# Altium project project.PrjPcb
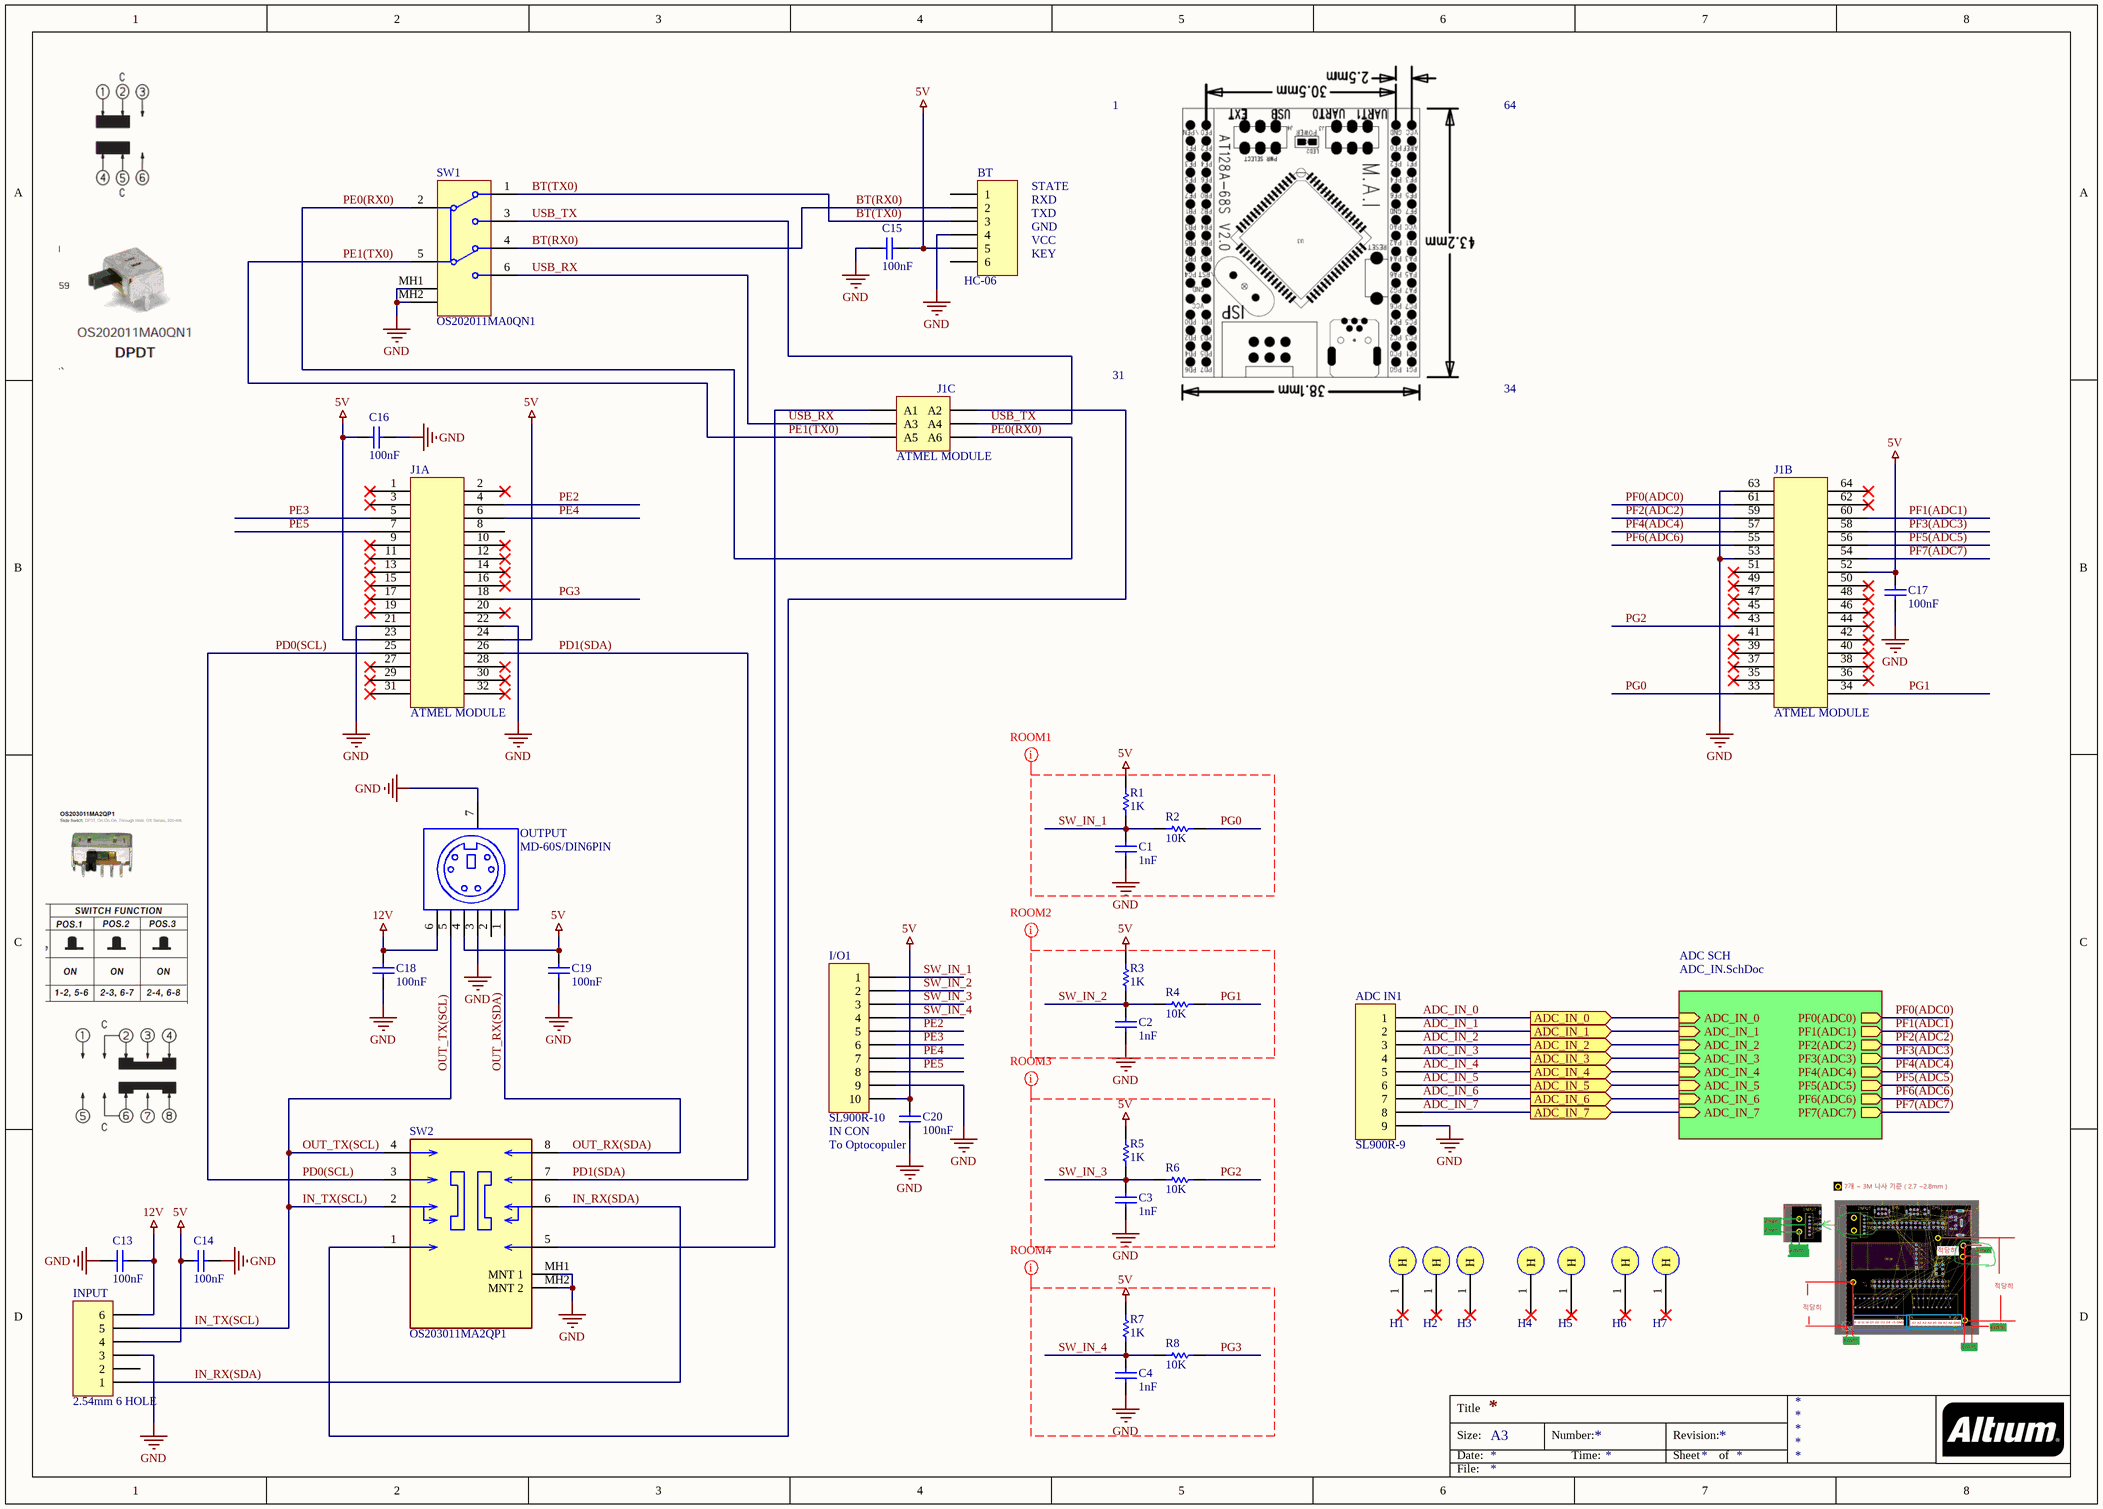
[diagram p0: CON_MCU.SchDoc]
2 sheets, 75 parts. Net scope: hierarchical (ports join the sheet entries above them; power ports are global).
Board file: Project.PcbDoc
Sheets:
  CON_MCU.SchDoc
    ADC SCH = ADC_IN.SchDoc

## Sheet CON_MCU.SchDoc
size A3

### Parts
ADC_IN1  SL900R-9  [SL-900R-9]
BT  HC-06  [HC-06]
C1  1nF  [C2012]
C2  1nF  [C2012]
C3  1nF  [C2012]
C4  1nF  [C2012]
C13  100nF  [C2012]
C14  100nF  [C2012]
C15  100nF  [C2012]
C16  100nF  [C2012]
C17  100nF  [C2012]
C18  100nF  [C2012]
C19  100nF  [C2012]
C20  100nF  [C2012]
H1  HOLE  [HOLE_3MM]  (value not drawn)
H2  HOLE  [HOLE_3MM]  (value not drawn)
H3  HOLE  [HOLE_3MM]  (value not drawn)
H4  HOLE  [HOLE_3MM]  (value not drawn)
H5  HOLE  [HOLE_3MM]  (value not drawn)
H6  HOLE  [HOLE_3MM]  (value not drawn)
H7  HOLE  [HOLE_3MM]  (value not drawn)
I/O1  SL900R-10  [SL-900R-10]
INPUT  2.54mm 6 HOLE  [2.54mm 6 HOLE]
J1  ATMEL MODULE  [ATMEL MODULE]  (parts A,B,C of 3)
OUTPUT  MD-60S/DIN6PIN  [TAIT-MDS-508B6L_V - duplicate]
R1  1K  [R2012]
R2  10K  [R2012]
R3  1K  [R2012]
R4  10K  [R2012]
R5  1K  [R2012]
R6  10K  [R2012]
R7  1K  [R2012]
R8  10K  [R2012]
SW1  OS202011MA0QN1  [OS202011MA0QN1]
SW2  OS203011MA2QP1  [OS203011MA2QP1]

### Sub-sheets
ADC SCH = ADC_IN.SchDoc: ADC_IN_0 (in), ADC_IN_1 (in), ADC_IN_2 (in), ADC_IN_3 (in), ADC_IN_4 (in), ADC_IN_5 (in), ADC_IN_6 (in), ADC_IN_7 (in), PF0(ADC0) (out), PF1(ADC1) (out), PF2(ADC2) (out), PF3(ADC3) (out), PF4(ADC4) (out), PF5(ADC5) (out), PF6(ADC6) (out), PF7(ADC7) (out)

### Ports
ADC_IN_0 (out), ADC_IN_1 (out), ADC_IN_2 (out), ADC_IN_3 (out), ADC_IN_4 (out), ADC_IN_5 (out), ADC_IN_6 (out), ADC_IN_7 (out)

### Nets
5V: BT.5 C14.2 C15.2 C16.2 C17.2 C19.2 C20.2 I/O1.10 INPUT.4 J1.23 J1.24 J1.52 OUTPUT.4 R1.2 R3.2 R5.2 R7.2
12V: C13.1 C18.2 INPUT.6 OUTPUT.6
GND: ADC_IN1.9 BT.4 C1.1 C2.1 C3.1 C4.1 C13.2 C14.1 C15.1 C16.1 C17.1 C18.1 C19.1 C20.1 I/O1.9 INPUT.3 J1.21 J1.22 J1.53 J1.63 OUTPUT.3 OUTPUT.7 SW1.MH1 SW1.MH2 SW2.MH1(MNT_1) SW2.MH2(MNT_2)
ADC_IN_0: ADC_IN1.1 ; port ADC_IN_0, sheet ADC SCH/ADC_IN_0
ADC_IN_1: ADC_IN1.2 ; port ADC_IN_1, sheet ADC SCH/ADC_IN_1
ADC_IN_2: ADC_IN1.3 ; port ADC_IN_2, sheet ADC SCH/ADC_IN_2
ADC_IN_3: ADC_IN1.4 ; port ADC_IN_3, sheet ADC SCH/ADC_IN_3
ADC_IN_4: ADC_IN1.5 ; port ADC_IN_4, sheet ADC SCH/ADC_IN_4
ADC_IN_5: ADC_IN1.6 ; port ADC_IN_5, sheet ADC SCH/ADC_IN_5
ADC_IN_6: ADC_IN1.7 ; port ADC_IN_6, sheet ADC SCH/ADC_IN_6
ADC_IN_7: ADC_IN1.8 ; port ADC_IN_7, sheet ADC SCH/ADC_IN_7
BT(RX0): BT.2 SW1.4
BT(TX0): BT.3 SW1.1
IN_RX(SDA): INPUT.1 SW2.6
IN_TX(SCL): INPUT.5 OUTPUT.5 SW2.2 SW2.4  [also labelled OUT_TX(SCL)]
OUT_RX(SDA): OUTPUT.1 SW2.8
PD0(SCL): J1.25 SW2.3
PD1(SDA): J1.26 SW2.7
PE0(RX0): J1.A6 SW1.2
PE1(TX0): J1.A5 SW1.5
PE2: I/O1.5 J1.4
PE3: I/O1.6 J1.5
PE4: I/O1.7 J1.6
PE5: I/O1.8 J1.7
PF0(ADC0): J1.61 ; sheet ADC SCH/PF0(ADC0)
PF1(ADC1): J1.60 ; sheet ADC SCH/PF1(ADC1)
PF2(ADC2): J1.59 ; sheet ADC SCH/PF2(ADC2)
PF3(ADC3): J1.58 ; sheet ADC SCH/PF3(ADC3)
PF4(ADC4): J1.57 ; sheet ADC SCH/PF4(ADC4)
PF5(ADC5): J1.56 ; sheet ADC SCH/PF5(ADC5)
PF6(ADC6): J1.55 ; sheet ADC SCH/PF6(ADC6)
PF7(ADC7): J1.54 ; sheet ADC SCH/PF7(ADC7)
PG0: J1.33 R2.1
PG1: J1.34 R4.1
PG2: J1.43 R6.1
PG3: J1.18 R8.1
SW_IN_1: C1.2 I/O1.1 R1.1 R2.2
SW_IN_2: C2.2 I/O1.2 R3.1 R4.2
SW_IN_3: C3.2 I/O1.3 R5.1 R6.2
SW_IN_4: C4.2 I/O1.4 R7.1 R8.2
USB_RX: J1.A3 SW1.6
USB_TX: J1.A4 SW1.3
NetJ1_A1: J1.A1 SW2.5
NetJ1_A2: J1.A2 SW2.1

Not connected (* = marked no-connect by the designer): BT 1 6; H1 1(H)*; H2 1(H)*; H3 1(H)*; H4 1(H)*; H5 1(H)*; H6 1(H)*; H7 1(H)*; INPUT 2; J1 1* 2* 3* 8 9* 10* 11* 12* 13* 14* 15* 16* 17* 19* 20* 27* 28* 29* 30* 31* 32* 35* 36* 37* 38* 39* 40* 41* 42* 44* 45* 46* 47* 48* 49* 50* 51* 62* 64*; OUTPUT 2

### Layout directives
mark named ROOM1: 5V, GND, PG0, SW_IN_1
mark named ROOM2: 5V, GND, PG1, SW_IN_2
mark named ROOM3: 5V, GND, PG2, SW_IN_3
mark named ROOM4: 5V, GND, PG3, SW_IN_4

### Notes on the sheet
- 1
- 64
- STATE
- RXD
- TXD
- GND
- VCC
- KEY
- 31
- 34
- IN CON
- (near C20) To Optocopuler
- Title
- Size:
- Date:
- A3
- Number:
- Time:
- Revision:
- Sheet
- of
- File:

### Library data of the parts
ADC_IN1 = Header 9: Header, 9-Pin; LatestRevisionDate: 17-Jul-2002; LatestRevisionNote: Re-released for DXP Platform.; Publisher: Altium Limited
BT INPUT = Header 6: Header, 6-Pin; LatestRevisionDate: 17-Jul-2002; LatestRevisionNote: Re-released for DXP Platform.; Publisher: Altium Limited
C1-C4 C13-C20 = CAP: Manufacturer: AVX Interconnect / Elco; Part Number: 08051A102JAT2A
H1-H7 = MH
I/O1 = Header 10: Header, 10-Pin; LatestRevisionDate: 17-Jul-2002; LatestRevisionNote: Re-released for DXP Platform.; Publisher: Altium Limited
OUTPUT = CUI-MD-60S-6: Right Angle Mini DIN Connector, 100 Vac, 12 Vdc, -40 to 85 degC, 6-Pin THD, RoHS, Bulk; Manufacturer: CUI Inc; Online Catalog: MD; Other Names: 045-0036RCP-2460MD60S; Connector Type: Receptacle,FemaleSockets; Mating Products: CP-2060-ND-CONNMINI-DIN6PINMALE; Number of Positions: 6; 3D Model: MD-60S; Current Rating: 1A,2A; Voltage - Rated: 100VAC,12VDC; Category: Connectors,Interconnects; Standard Package: 300; Mounting Technology: ThroughHole; RoHS Information: MD-x0SCertofCompliance; Operating Temperature: -40°C~85°C; Contact Finish: Silver; Orientation: Keyed; Package Reference: MD-60S; Package Description: 6-Pin Through Hole Device, Body 14 x 12.4 mm, Height 13.1 mm; Shell Material, Finish: PolybutyleneTerephthalate(PBT); Packaging: Bulk; Fastening Type: Push-Pull; Contact Finish Thickness: -; Shell Size, MIL: -; Termination: Solder; Manufacturer URL: http://www.cui.com/; Family: CircularConnectors; Series: MD; Mounting Type: ThroughHole,RightAngle; Features: -; Ingress Protection: -; Datasheet Version: Rev. 1.02, 03/2012; Datasheet URL: http://www.cui.com/product/resource/md-xxs.pdf; Shell Size - Insert: MiniDIN
R1-R8 = RES-2: Chip Resistor, 4.7 KOhm, +/- 1%, 0.125 W, -55 to 155 degC, 0805 (2012 Metric), RoHS, Tape and Reel; Manufacturer: Vishay Semiconductor; Temperature Coefficient: 100ppm/degreesC; Voltage Rating: 150V; Max Power Dissipation: 125mW; Packaging: TapeandReel; Max Operating Temperature: 155degC; Case Code (Imperial): 0805; Case/Package: 0805; Radiation Hardening: No; Package Reference: 0805; Lead Free: LeadFree; Package Description: 2-Pin Surface Mount Device, Body 2.05 x 1.25 mm; Manufacturer URL: http://www.vishay.com/; Tolerance: 1%; Height: 0.45mm; REACH SVHC: Unknown; Termination: SMD/SMT; Length: 2mm; Depth: 1.25mm; Case Code (Metric): 2012; Package Quantity: 10; Weight: 0.000194oz; Military Standard: Not; RoHSCompliant: true; Composition: ThickFilm; Contact Plating: Tin; Datasheet Version: 41061.0; Datasheet URL: https://datasheet.ciiva.com/11808/0900766b80d98b26-11808992.pdf; Width: 1.25mm; Number of Terminations: 2; Min Operating Temperature: -55degC; Power Rating: 125mW; Resistance: 4.7KOhm; Voltage Rating (DC): 150V
SW1 = SW-DPDT-6: Slide Switch, MHS Series, Double Pole, Vertical, 125 V (AC), -20 to 85 degC, 6-Pin THD, RoHS, Bulk; ComponentLink2Description: Datasheet; DatasheetVersion: Mar-08; PackageDescription: 6-Pin Through Hole Device, Body 16 x 6.7 mm, Height 12.05 mm; ComponentLink1URL: http://www.te.com/; ComponentLink1Description: Manufacturer URL; ComponentLink3Description: Package Specification; ComponentLink2URL: http://www.te.com/commerce/DocumentDelivery/DDEController?Action=showdoc&DocId=Catalog+Section%7F1308111-1_SWITCHES_CORE_PROGRAM_CATALOG%7F0308%7Fpdf%7FEnglish%7FENG_CS_1308111-1_SWITCHES_CORE_PROGRAM_CATALOG_0308.pdf%7F1825289-1; PackageReference: 1825289-1; ComponentLink3URL: http://www.te.com/commerce/DocumentDelivery/DDEController?Action=showdoc&DocId=Customer+Drawing%7F1825289%7FB3%7Fpdf%7FEnglish%7FENG_CD_1825289_B3.pdf%7F1825289-1
SW2 = CMP-17877-000002-1: SWITCH SLIDE DP3T 200MA 30V; Manufacturer Part Number: EG2301; Manufacturer: E-Switch; Electromechanical Life: 10000Cycles; Contact Resistance: 20mΩ; Current Rating: 0.2A; Temperature Range Low: -20°C; Throw Configuration: DP3T; Digikey Description: SWITCH SLIDE DP3T 200MA 30V; Device Class L2: Switches; RoHS: TRUE; Temperature Range High: +70°C; Mount: Through Hole; Lead Free: Yes; ComponentLink2Description: Datasheet; Footprint Url: http://spec_sheets.e-switch.com/specs/P040180.pdf; Category: Switch; Temperature: -20°C to +70°C; Package: EG2301; Automotive: No; Device Class L1: Electromechanical; Device Class L3: Slide Switches; ComponentLink2URL: https://www.e-switch.com/system/asset/product_line/data_sheet/119/EG.pdf; Height: 11.8mm; Octopart: https://octopart.com/eg2301-e-switch-1438660; Mouser Description: Slide Switches DP3T PC MNT SLIDE; Voltage Rating Dc: 30V; Manufacturer 1: E-Switch; Manufacturer Part Number 1: EG2301

## Sheet ADC_IN.SchDoc
size A4
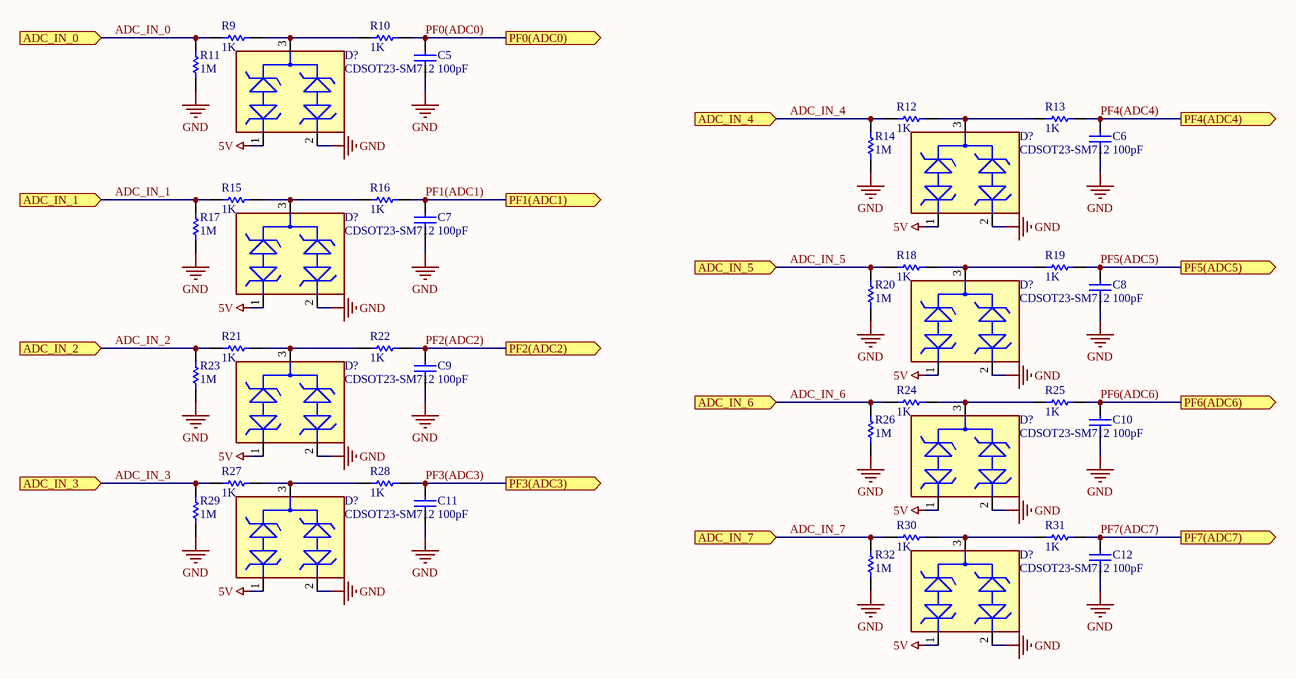
[diagram p1: ADC_IN.SchDoc]

### Parts
(Parts that share a designator on the sheet are numbered #1, #2 ... from top to bottom, then left to right.)
C5  100pF  [C2012]
C6  100pF  [C2012]
C7  100pF  [C2012]
C8  100pF  [C2012]
C9  100pF  [C2012]
C10  100pF  [C2012]
C11  100pF  [C2012]
C12  100pF  [C2012]
D?#1  CDSOT23-SM712  [FP-SOT23-MFG]
D?#2  CDSOT23-SM712  [FP-SOT23-MFG]
D?#3  CDSOT23-SM712  [FP-SOT23-MFG]
D?#4  CDSOT23-SM712  [FP-SOT23-MFG]
D?#5  CDSOT23-SM712  [FP-SOT23-MFG]
D?#6  CDSOT23-SM712  [FP-SOT23-MFG]
D?#7  CDSOT23-SM712  [FP-SOT23-MFG]
D?#8  CDSOT23-SM712  [FP-SOT23-MFG]
R9  1K  [R2012]
R10  1K  [R2012]
R11  1M  [R2012]
R12  1K  [R2012]
R13  1K  [R2012]
R14  1M  [R2012]
R15  1K  [R2012]
R16  1K  [R2012]
R17  1M  [R2012]
R18  1K  [R2012]
R19  1K  [R2012]
R20  1M  [R2012]
R21  1K  [R2012]
R22  1K  [R2012]
R23  1M  [R2012]
R24  1K  [R2012]
R25  1K  [R2012]
R26  1M  [R2012]
R27  1K  [R2012]
R28  1K  [R2012]
R29  1M  [R2012]
R30  1K  [R2012]
R31  1K  [R2012]
R32  1M  [R2012]

### Ports
ADC_IN_0 (in), ADC_IN_1 (in), ADC_IN_2 (in), ADC_IN_3 (in), ADC_IN_4 (in), ADC_IN_5 (in), ADC_IN_6 (in), ADC_IN_7 (in), PF0(ADC0) (out), PF1(ADC1) (out), PF2(ADC2) (out), PF3(ADC3) (out), PF4(ADC4) (out), PF5(ADC5) (out), PF6(ADC6) (out), PF7(ADC7) (out)

### Nets
5V: D?#1.1 D?#2.1 D?#3.1 D?#4.1 D?#5.1 D?#6.1 D?#7.1 D?#8.1
GND: C5.2 C6.2 C7.2 C8.2 C9.2 C10.2 C11.2 C12.2 D?#1.2 D?#2.2 D?#3.2 D?#4.2 D?#5.2 D?#6.2 D?#7.2 D?#8.2 R11.2 R14.2 R17.2 R20.2 R23.2 R26.2 R29.2 R32.2
ADC_IN_0: R9.2 R11.1 ; port ADC_IN_0
ADC_IN_1: R15.2 R17.1 ; port ADC_IN_1
ADC_IN_2: R21.2 R23.1 ; port ADC_IN_2
ADC_IN_3: R27.2 R29.1 ; port ADC_IN_3
ADC_IN_4: R12.2 R14.1 ; port ADC_IN_4
ADC_IN_5: R18.2 R20.1 ; port ADC_IN_5
ADC_IN_6: R24.2 R26.1 ; port ADC_IN_6
ADC_IN_7: R30.2 R32.1 ; port ADC_IN_7
PF0(ADC0): C5.1 R10.1 ; port PF0(ADC0)
PF1(ADC1): C7.1 R16.1 ; port PF1(ADC1)
PF2(ADC2): C9.1 R22.1 ; port PF2(ADC2)
PF3(ADC3): C11.1 R28.1 ; port PF3(ADC3)
PF4(ADC4): C6.1 R13.1 ; port PF4(ADC4)
PF5(ADC5): C8.1 R19.1 ; port PF5(ADC5)
PF6(ADC6): C10.1 R25.1 ; port PF6(ADC6)
PF7(ADC7): C12.1 R31.1 ; port PF7(ADC7)
NetD?#1_3: D?#1.3 R9.1 R10.2
NetD?#2_3: D?#2.3 R12.1 R13.2
NetD?#3_3: D?#3.3 R15.1 R16.2
NetD?#4_3: D?#4.3 R18.1 R19.2
NetD?#5_3: D?#5.3 R21.1 R22.2
NetD?#6_3: D?#6.3 R24.1 R25.2
NetD?#7_3: D?#7.3 R27.1 R28.2
NetD?#8_3: D?#8.3 R30.1 R31.2

### Notes on the sheet
- Title
- Size:
- Date:
- A4
- Number:
- Time:
- Revision:
- Sheet
- of
- File:

### Library data of the parts
C5-C12 = CAP: as C1 on sheet CON_MCU
D?#1-D?#8 = CMP-2000-05081-2: TVS DIODE 7V/12V 14V/26V SOT23-3; Manufacturer: Bourns Inc.; Manufacturer: Bourns; Peak Pulse Current: 17A; Standoff Height: 0.05mm; Breakdown Voltage: 7.5V; Direction: Bidirectional; Description: 26V, 14V Clamp 17A (8/20µs) Ipp Tvs Diode Surface Mount SOT-23-3; Clamping Voltage: 26V; Value: 75pF; Number Of Channels: 2; Reverse Standoff Voltage: 12V; Peak Pulse Power: 400W; Temperature Range Low: -55°C; Mouser Description: Transient Voltage Suppressor, TVS, CDSOT23 Series, Unidirectional, 12 V, SOT-23, 3, 13.3 V; Device Class L3: unset; Package: SOT23; Height: 1.17mm; RoHS: TRUE; Octopart: https://octopart.com/cdsot23-sm712-bourns-7576327; Category: Diode; Ipc Land Pattern Name: SOT95P229X103-3; ComponentLink2URL: https://www.bourns.com/docs/Product-Datasheets/CDSOT23-SM712.pdf; Temperature Range High: +150°C; ComponentLink2Description: Datasheet; Digikey Description: TVS DIODE 7V/12V 14V/26V SOT23-3; Manufacturer Part Number: CDSOT23-SM712; Temperature: -55°C to +150°C; Device Class L2: TVS Diodes; Lead Free: Yes; Device Class L1: Circuit Protection; Automotive: No; Capacitance: 75pF
R9-R32 = RES-2: as R1 on sheet CON_MCU; Packaging: TapeandReel; Max Operating Temperature: 155degC; Case Code (Imperial): 0805; Case/Package: 0805; Radiation Hardening: No; Package Reference: 0805; Lead Free: LeadFree; Package Description: 2-Pin Surface Mount Device, Body 2.05 x 1.25 mm; Manufacturer URL: http://www.vishay.com/; Tolerance: 1%; Height: 0.45mm; REACH SVHC: Unknown; Termination: SMD/SMT; Length: 2mm; Depth: 1.25mm; Case Code (Metric): 2012; Package Quantity: 10; Weight: 0.000194oz; Military Standard: Not; RoHSCompliant: true; Composition: ThickFilm; Contact Plating: Tin; Datasheet Version: 41061.0; Datasheet URL: https://datasheet.ciiva.com/11808/0900766b80d98b26-11808992.pdf; Width: 1.25mm; Number of Terminations: 2; Min Operating Temperature: -55degC; Power Rating: 125mW; Resistance: 4.7KOhm; Voltage Rating (DC): 150V

## Nets that join several sheets
5V: CON_MCU (17 pins), ADC_IN (8 pins)
GND: CON_MCU (26 pins), ADC_IN (24 pins)
ADC_IN_0: CON_MCU (ADC_IN1.1), ADC_IN (R9.2 R11.1)
ADC_IN_1: CON_MCU (ADC_IN1.2), ADC_IN (R15.2 R17.1)
ADC_IN_2: CON_MCU (ADC_IN1.3), ADC_IN (R21.2 R23.1)
ADC_IN_3: CON_MCU (ADC_IN1.4), ADC_IN (R27.2 R29.1)
ADC_IN_4: CON_MCU (ADC_IN1.5), ADC_IN (R12.2 R14.1)
ADC_IN_5: CON_MCU (ADC_IN1.6), ADC_IN (R18.2 R20.1)
ADC_IN_6: CON_MCU (ADC_IN1.7), ADC_IN (R24.2 R26.1)
ADC_IN_7: CON_MCU (ADC_IN1.8), ADC_IN (R30.2 R32.1)
PF0(ADC0): CON_MCU (J1.61), ADC_IN (C5.1 R10.1)
PF1(ADC1): CON_MCU (J1.60), ADC_IN (C7.1 R16.1)
PF2(ADC2): CON_MCU (J1.59), ADC_IN (C9.1 R22.1)
PF3(ADC3): CON_MCU (J1.58), ADC_IN (C11.1 R28.1)
PF4(ADC4): CON_MCU (J1.57), ADC_IN (C6.1 R13.1)
PF5(ADC5): CON_MCU (J1.56), ADC_IN (C8.1 R19.1)
PF6(ADC6): CON_MCU (J1.55), ADC_IN (C10.1 R25.1)
PF7(ADC7): CON_MCU (J1.54), ADC_IN (C12.1 R31.1)